# EAGLE design SparkFun_IMU_Breakout_ICM-20948_FET_EVAL (EAGLE 9.1.3)
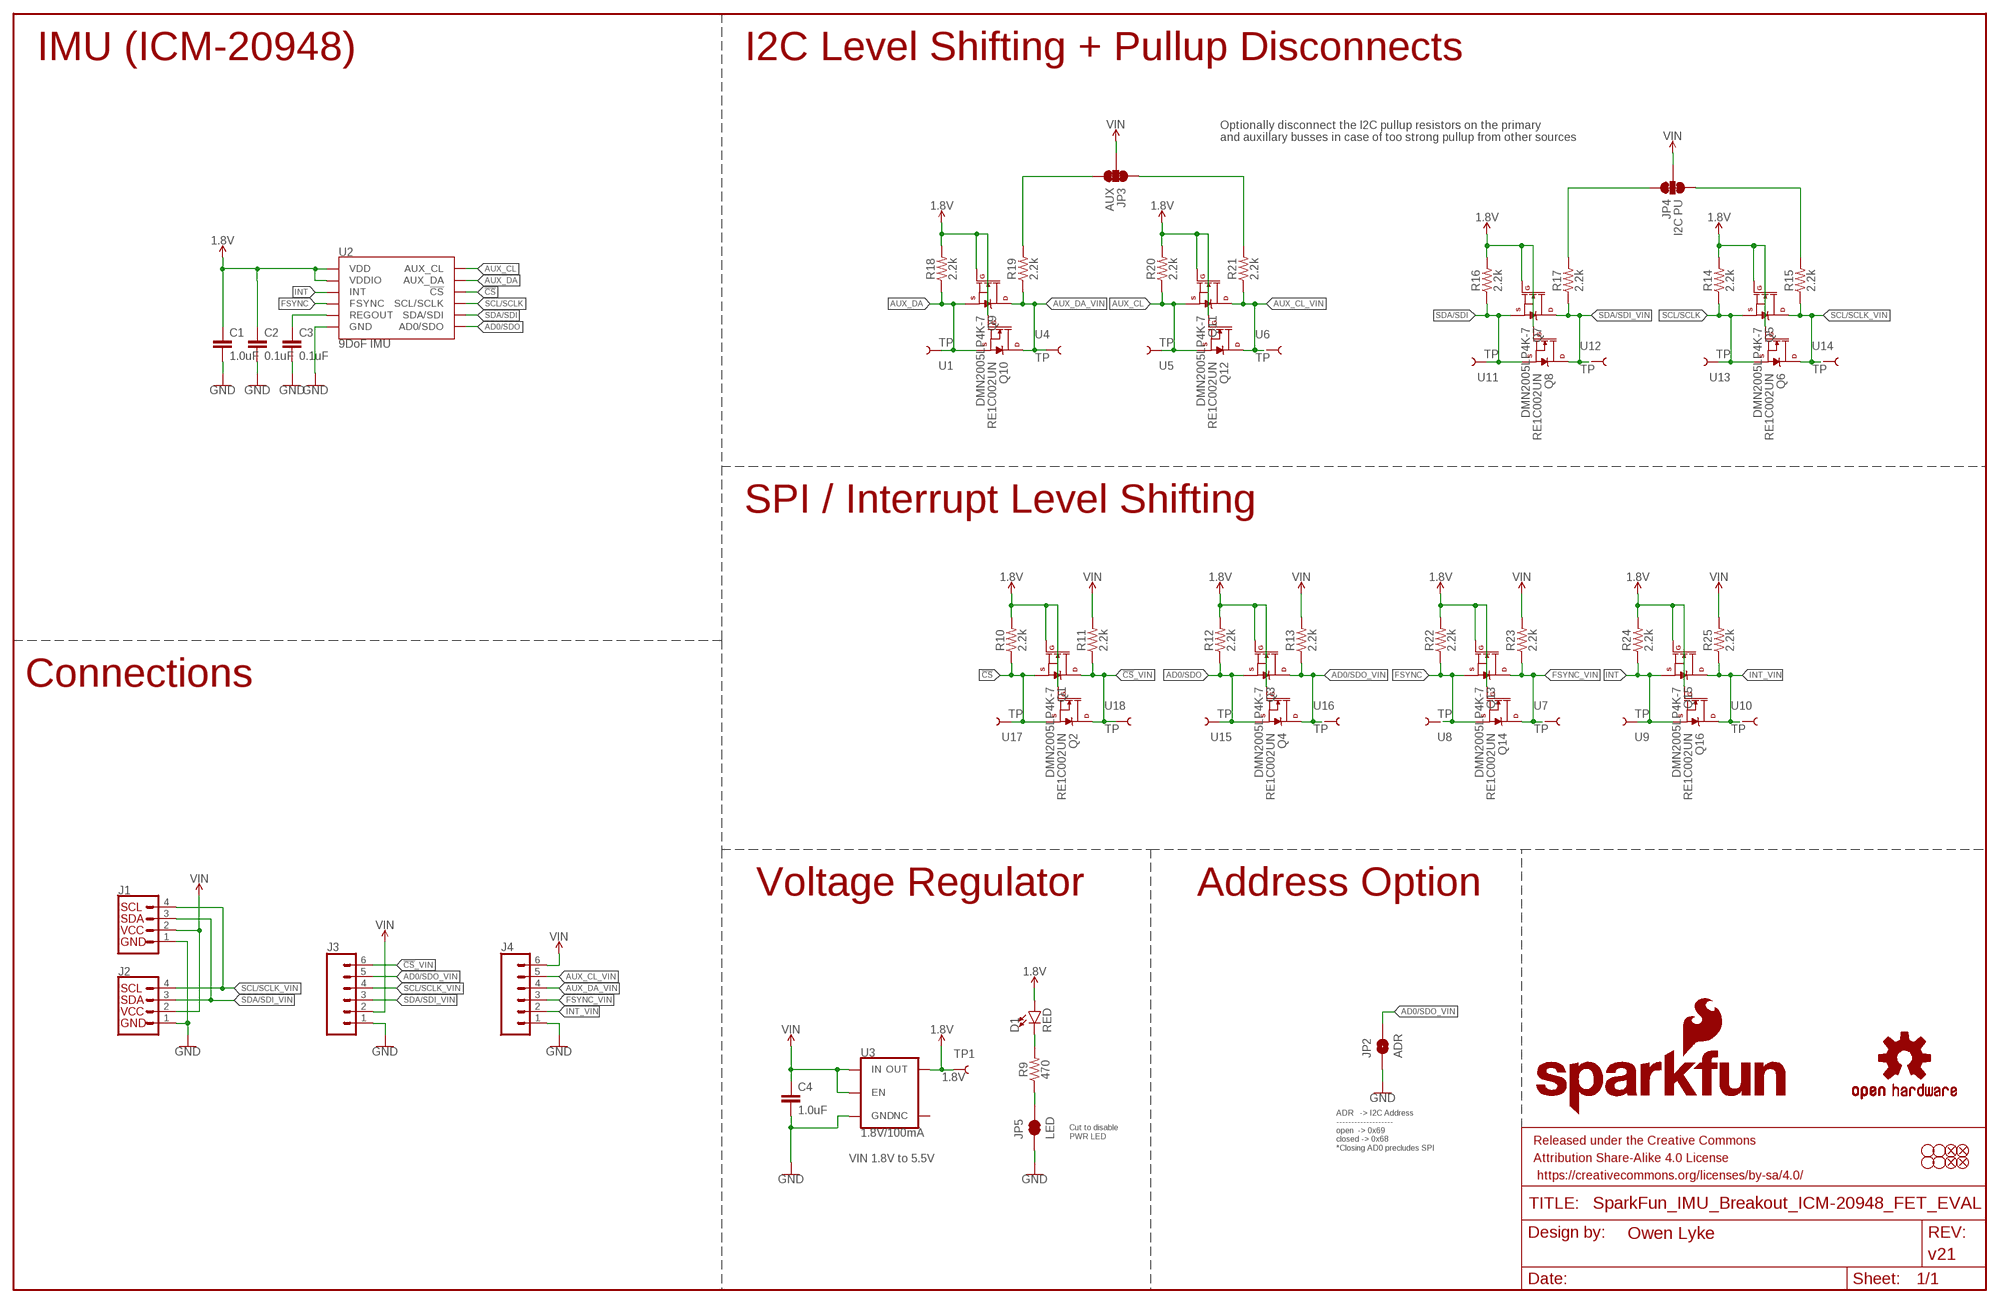
[diagram p0: schematic, sheet 1]

## Parts
C1  1.0uF  1.0UF-0603-16V-10%-X7R  [0603]
C2  0.1uF  0.1UF-0603-25V-5%  [0603]
C3  0.1uF  0.1UF-0603-25V-5%  [0603]
C4  1.0uF  1.0UF-0603-16V-10%-X7R  [0603]
D1  RED  LED-RED0603  [LED-0603]
FD1  FIDUCIAL1X2  [FIDUCIAL-1X2]
FD2  FIDUCIAL1X2  [FIDUCIAL-1X2]
FD3  FIDUCIAL1X2  [FIDUCIAL-1X2]
FD4  FIDUCIAL1X2  [FIDUCIAL-1X2]
FRAME2  FRAME-LEDGER  [CREATIVE_COMMONS]
H1  STAND-OFF  [STAND-OFF]
H2  STAND-OFF  [STAND-OFF]
H3  STAND-OFF  [STAND-OFF]
H4  STAND-OFF  [STAND-OFF]
J1  QWIIC_CONNECTORJS-1MM  [JST04_1MM_RA]
J2  QWIIC_CONNECTORJS-1MM  [JST04_1MM_RA]
J3  CONN_06NO_SILK_NO_POP  [1X06_NO_SILK]
J4  CONN_06NO_SILK_NO_POP  [1X06_NO_SILK]
JP2  ADR  JUMPER-SMT_2_NO_SILK  [SMT-JUMPER_2_NO_SILK]
JP3  AUX  JUMPER-SMT_3_2-NC_TRACE_SILK  [SMT-JUMPER_3_2-NC_TRACE_SILK]
JP4  I2C PU  JUMPER-SMT_3_2-NC_TRACE_SILK  [SMT-JUMPER_3_2-NC_TRACE_SILK]
JP5  LED  JUMPER-SMT_2_NC_TRACE_SILK  [SMT-JUMPER_2_NC_TRACE_SILK]
LOGO1  SFE_LOGO_NAME_FLAME.1_INCH  [SFE_LOGO_NAME_FLAME_.1]
LOGO2  OSHW-LOGOMINI  [OSHW-LOGO-MINI]
Q1  DMN2005LP4K-7  [AP02001]
Q2  RE1C002UN  [SOT-416FL]
Q3  DMN2005LP4K-7  [AP02001]
Q4  RE1C002UN  [SOT-416FL]
Q5  DMN2005LP4K-7  [AP02001]
Q6  RE1C002UN  [SOT-416FL]
Q7  DMN2005LP4K-7  [AP02001]
Q8  RE1C002UN  [SOT-416FL]
Q9  DMN2005LP4K-7  [AP02001]
Q10  RE1C002UN  [SOT-416FL]
Q11  DMN2005LP4K-7  [AP02001]
Q12  RE1C002UN  [SOT-416FL]
Q13  DMN2005LP4K-7  [AP02001]
Q14  RE1C002UN  [SOT-416FL]
Q15  DMN2005LP4K-7  [AP02001]
Q16  RE1C002UN  [SOT-416FL]
R9  470  470OHM-0603-1/10W-1%  [0603]
R10  2.2k  2.2KOHM-0402T-1/16W-1%  [0402-TIGHT]
R11  2.2k  2.2KOHM-0402T-1/16W-1%  [0402-TIGHT]
R12  2.2k  2.2KOHM-0402T-1/16W-1%  [0402-TIGHT]
R13  2.2k  2.2KOHM-0402T-1/16W-1%  [0402-TIGHT]
R14  2.2k  2.2KOHM-0402T-1/16W-1%  [0402-TIGHT]
R15  2.2k  2.2KOHM-0402T-1/16W-1%  [0402-TIGHT]
R16  2.2k  2.2KOHM-0402T-1/16W-1%  [0402-TIGHT]
R17  2.2k  2.2KOHM-0402T-1/16W-1%  [0402-TIGHT]
R18  2.2k  2.2KOHM-0402T-1/16W-1%  [0402-TIGHT]
R19  2.2k  2.2KOHM-0402T-1/16W-1%  [0402-TIGHT]
R20  2.2k  2.2KOHM-0402T-1/16W-1%  [0402-TIGHT]
R21  2.2k  2.2KOHM-0402T-1/16W-1%  [0402-TIGHT]
R22  2.2k  2.2KOHM-0402T-1/16W-1%  [0402-TIGHT]
R23  2.2k  2.2KOHM-0402T-1/16W-1%  [0402-TIGHT]
R24  2.2k  2.2KOHM-0402T-1/16W-1%  [0402-TIGHT]
R25  2.2k  2.2KOHM-0402T-1/16W-1%  [0402-TIGHT]
TP1  1.8V  TEST-POINT3  [PAD.03X.03]
U1  TP  [MINI_TEST_POINT]
U2  9DoF IMU  ICM-20948  [QFN24-3X3]
U3  1.8V/100mA  V_REG_SP6214-1.8V  [SC70]
U4  TP  [MINI_TEST_POINT]
U5  TP  [MINI_TEST_POINT]
U6  TP  [MINI_TEST_POINT]
U7  TP  [MINI_TEST_POINT]
U8  TP  [MINI_TEST_POINT]
U9  TP  [MINI_TEST_POINT]
U10  TP  [MINI_TEST_POINT]
U11  TP  [MINI_TEST_POINT]
U12  TP  [MINI_TEST_POINT]
U13  TP  [MINI_TEST_POINT]
U14  TP  [MINI_TEST_POINT]
U15  TP  [MINI_TEST_POINT]
U16  TP  [MINI_TEST_POINT]
U17  TP  [MINI_TEST_POINT]
U18  TP  [MINI_TEST_POINT]

## Nets
1.8V: C1.1 C2.1 D1.A Q1.G Q2.1(G) Q3.G Q4.1(G) Q5.G Q6.1(G) Q7.G Q8.1(G) Q9.G Q10.1(G) Q11.G Q12.1(G) Q13.G Q14.1(G) Q15.G Q16.1(G) R10.2 R12.2 R14.2 R16.2 R18.2 R20.2 R22.2 R24.2 TP1.P$1 U2.8(VDDIO) U2.13(VDD) U3.5(OUT)
!CS: Q1.S Q2.2(S) R10.1 U2.22(!CS) U17.P$1
!CS!_VIN: J3.6 Q1.D Q2.3(D) R11.1 U18.P$1
AD0/SDO: Q3.S Q4.2(S) R12.1 U2.9(AD0/SDO) U15.P$1
AD0/SDO_VIN: J3.5 JP2.2 Q3.D Q4.3(D) R13.1 U16.P$1
AUX_CL: Q11.S Q12.2(S) R20.1 U2.7(AUX_CL) U5.P$1
AUX_CL_VIN: J4.5 Q11.D Q12.3(D) R21.1 U6.P$1
AUX_DA: Q9.S Q10.2(S) R18.1 U1.P$1 U2.21(AUX_DA)
AUX_DA_VIN: J4.4 Q9.D Q10.3(D) R19.1 U4.P$1
FSYNC: Q13.S Q14.2(S) R22.1 U2.11(FSYNC) U8.P$1
FSYNC_VIN: J4.3 Q13.D Q14.3(D) R23.1 U7.P$1
GND: C1.2 C2.2 C3.2 C4.2 J1.1 J2.1 J3.1 J4.1 JP2.1 JP5.1 U2.18(GND) U2.20(GND) U3.2(GND)
INT: Q15.S Q16.2(S) R24.1 U2.12(INT) U9.P$1
INT_VIN: J4.2 Q15.D Q16.3(D) R25.1 U10.P$1
N$1: C3.1 U2.10(REGOUT)
N$2: JP4.3 R15.2
N$3: JP4.1 R17.2
N$4: JP3.1 R21.2
N$5: JP3.3 R19.2
N$9: D1.C R9.2
N$10: JP5.2 R9.1
SCL/SCLK: Q5.S Q6.2(S) R14.1 U2.23(SCL/SCLK) U13.P$1
SCL/SCLK_VIN: J1.4 J2.4 J3.4 Q5.D Q6.3(D) R15.1 U14.P$1
SDA/SDI: Q7.S Q8.2(S) R16.1 U2.24(SDA/SDI) U11.P$1
SDA/SDI_VIN: J1.3 J2.3 J3.3 Q7.D Q8.3(D) R17.1 U12.P$1
VIN: C4.1 J1.2 J2.2 J3.2 J4.6 JP3.2 JP4.2 R11.2 R13.2 R23.2 R25.2 U3.1(IN) U3.3(EN)
Unconnected: U3.4(NC)

## Notes on the sheet
- IMU (ICM-20948) | I2C Level Shifting + Pullup Disconnects
- Optionally disconnect the I2C pullup resistors on the primary
  and auxillary busses in case of too strong pullup from other sources
- SPI / Interrupt Level Shifting
- Connections
- Voltage Regulator | Address Option
- Cut to disable
  PWR LED
- ADR   -> I2C Address
  -------------------
  open  -> 0x69
  closed -> 0x68
  *Closing AD0 precludes SPI
- VIN 1.8V to 5.5V

## Library data of the parts
C1 C4 = SparkFun-Capacitors:1.0UF: 1µF ceramic capacitors A capacitor is a passive two-terminal electrical component used to store electrical energy temporarily in an electric field.; PROD_ID: CAP-13930
C2 C3 = SparkFun-Capacitors:0.1UF: 0.1µF ceramic capacitors A capacitor is a passive two-terminal electrical component used to store electrical energy temporarily in an electric field.; PROD_ID: CAP-08604
D1 = SparkFun-LED:LED-RED: Red SMD LED Used in manufacturing of most products at SparkFun Packages: 0603 - SMD 0603 package [Product Link] <http://docs.avagotech.com/docs/AV02-0551EN> 0603 SMART - SMD 0603 SMART package ( more efficient and expensive)[Product Link] <http://www.osram-os.com/Graphics/XPic2/00077099_0.pdf> 1206 - SMD1206 package [Product Link] <https://www.sparkfun.com/datasheets/DevTools/LilyPad/Q150OVS4.pdff> SparkFun Products: Pro Mini 328 -5V <https://www.sparkfun.com/products/821> RedBoard <https://www.sparkfun.com/products/12757> IOIO-OTG <https://www.sparkfun.com/products/13613>; PROD_ID: DIO-00819
FD1-FD4 = SparkFun-Aesthetics:FIDUCIAL: Fiducial Alignment Points Point-of-reference for pick-and-place machines and other optical instruments.
FRAME2 = SparkFun-Aesthetics:FRAME-LEDGER: Schematic Frame - Ledger Standard 11x14 US Ledger frame; DESIGNER: Owen Lyke; REV: v21
H1-H4 = SparkFun-Hardware:STAND-OFF: Stand Off Drill holes for mechanically mounting via screws, standoffs, etc. Note: Use the keepout ring to avoid running the screw head into surrounding components. Variant Overviews STAND-OFF - Mechanical footprint for a #4 phillips button head screw. STAND-OFF-TIGHT - Mechanical footprint for a #4 phillips button head screw, Example SparkFun Products Screw - Phillips Head (1/4", 4-40, 10 pack) <https://www.sparkfun.com/products/10453> (PRT-10453) Screw - Phillips Head (1/2", 4-40, 10 pack) <https://www.sparkfun.com/products/10452> (PRT-10452) Screw - Phillips Head (3/4", 4-40, 10 pack) <https://www.sparkfun.com/products/10451> (PRT-10451) Screw - Phillips Head (1", 4-40, 10 pack) <https://www.sparkfun.com/products/10450> (PRT-10450)
J1 J2 = SparkFun-Connectors:QWIIC_CONNECTOR: SparkFun I2C Standard Qwiic Connector An SMD 1mm pitch JST connector makes it easy and quick (get it? Qwiic?) to connect I2C devices to each other. The Qwiic system <http://www.sparkfun.com/qwiic> enables fast and solderless connection between popular platforms and various sensors and actuators. We carry 200mm <https://www.sparkfun.com/products/14204>, 100mm <https://www.sparkfun.com/products/14205>, 50mm <https://www.sparkfun.com/products/14206>, and breadboard friendly <https://www.sparkfun.com/products/14207> Qwiic cables. We also offer 10 pcs strips <https://www.sparkfun.com/products/14323> the SMD connectors.; PROD_ID: CONN-13694
J3 J4 = SparkFun-Connectors:CONN_06: Multi connection point. Often used as Generic Header-pin footprint for 0.1 inch spaced/style header connections On any of the 0.1 inch spaced packages, you can populate with these: Break Away Headers - Straight <https://www.sparkfun.com/products/116> (PRT-00116) Break Away Male Headers - Right Angle <https://www.sparkfun.com/products/553> (PRT-00553) Female Headers <https://www.sparkfun.com/products/115> (PRT-00115) Break Away Headers - Machine Pin <https://www.sparkfun.com/products/117> (PRT-00117) Break Away Female Headers - Swiss Machine Pin <https://www.sparkfun.com/products/743> (PRT-00743) Arduino Stackable Header - 6 Pin <https://www.sparkfun.com/products/9280> (PRT-09280) For SCREWTERMINALS and SPRING TERMINALS visit here: Screw Terimnals on SparkFun.com <https://www.sparkfun.com/search/results?term=Screw+Terminals> (5mm/3.5mm/2.54mm spacing) This device is also useful as a general connection point to wire up your design to another part of your project. Our various solder wires solder well into these plated through hole pads. Hook-Up Wire - Assortment (Stranded, 22 AWG) <https://www.sparkfun.com/products/11375> (PRT-11375) Hook-Up Wire - Assortment (Solid Core, 22 AWG) <https://www.sparkfun.com/products/11367> (PRT-11367) View the entire wire category on our website here <https://www.sparkfun.com/categories/141>
JP2 = SparkFun-Jumpers:JUMPER-SMT_2_NO: Normally open jumper This jumper has two pads in close proximity to each other. Apply solder to close the connection. Round pads are easier to solder for beginners, but are a lot larger. SparkFun Product that uses the round pads: SparkFun EL Sequencer <https://www.sparkfun.com/products/12781>
JP3 JP4 = SparkFun-Jumpers:JUMPER-SMT_3_2-NC_TRACE: Normally closed trace jumper (2 of 2 connections) This jumper has a trace between all three pads so they are normally closed (NC). Use a razor knife to open the connection(s). For best results follow the IPC guidelines for cutting traces: Cutout at least 0.063 mm (0.005 in). Remove all loose material to clean up the cut area. Seal the cut with an approved epoxy. Reapply solder to reclose the connection(s).
JP5 = SparkFun-Jumpers:JUMPER-SMT_2_NC_TRACE: Normally closed trace jumper This jumper has a trace between two pads so it's normally closed (NC). Use a razor knife to open the connection. For best results follow the IPC guidelines for cutting traces: Cutout at least 0.063 mm (0.005 in). Remove all loose material to clean up the cut area. Seal the cut with an approved epoxy. Reapply solder to reclose the connection.
LOGO1 = SparkFun-Aesthetics:SFE_LOGO_NAME_FLAME: SparkFun Font Logo w/ Flame This is the SparkFun full logo. The logo on the schematic will always be the same size; the package variant is the height of the flame part of the logo. Default layer for the logo on the board is tSilk.
LOGO2 = SparkFun-Aesthetics:OSHW-LOGO: Open-Source Hardware (OSHW) Logo This logo indicates the piece of hardware it is found on incorporates a OSHW license and/or adheres to the definition of open source hardware found here: http://freedomdefined.org/OSHW
Q1 Q3 Q5 Q7 Q9 Q11 Q13 Q15 = new_fets:DMN2005LP4K-7
Q2 Q4 Q6 Q8 Q10 Q12 Q14 Q16 = new_fets:RE1C002UN
R9 = SparkFun-Resistors:470OHM: 470Ω resistor A resistor is a passive two-terminal electrical component that implements electrical resistance as a circuit element. Resistors act to reduce current flow, and, at the same time, act to lower voltage levels within circuits. - Wikipedia; PROD_ID: RES-07869
R10-R25 = SparkFun-Resistors:2.2KOHM: 2.2kΩ resistor A resistor is a passive two-terminal electrical component that implements electrical resistance as a circuit element. Resistors act to reduce current flow, and, at the same time, act to lower voltage levels within circuits. - Wikipedia; PROD_ID: RES-14341
TP1 = SparkFun-Connectors:TEST-POINT: SparkFun Test Points Bare copper test points for troubleshooting or In-Circuit-Testing. These are used by our Production team for verifying production board runs using pogo-pins on test beds. SparkFun Products: SparkFun LSM9DS1 Breakout <https://www.sparkfun.com/products/13284> SparkFun PSOC <https://www.sparkfun.com/products/13714> SparkFun Load Cell Amplifier <https://www.sparkfun.com/products/13879>
U1 U4-U18 = new_fets:TP
U2 = SparkFun-Sensors:ICM-20948: ICM-20948 9 Degree of Freedom IMU World’s lowest power 9-axis MotionTracking device that is ideally suited for smartphones, tablets, wearable sensors, and IoT applications. Includes onboard Digital Motion Processor to offload computations from the host processor Datasheet <https://cdn.sparkfun.com/assets/learn_tutorials/5/5/0/MPU9250REV1.0.pdf> SparkFun Products: SparkFun IMU Breakout - ICM-20948 <https://www.sparkfun.com/products/15182>; PROD_ID: IC-14247
U3 = SparkFun-IC-Power:V_REG_SP6214: Voltage Regulator - SP6214 SP6214 Series SC-70-5 Micropower SC-70 100 mA CMOS LDO Regulator Datasheet <https://www.exar.com/content/document.ashx?id=654> SparkFun Products: MP3 Trigger <https://www.sparkfun.com/products/13720> SparkFun Particle Sensor Breakout <https://www.sparkfun.com/products/14045>; PROD_ID: VREG-08428

## Board
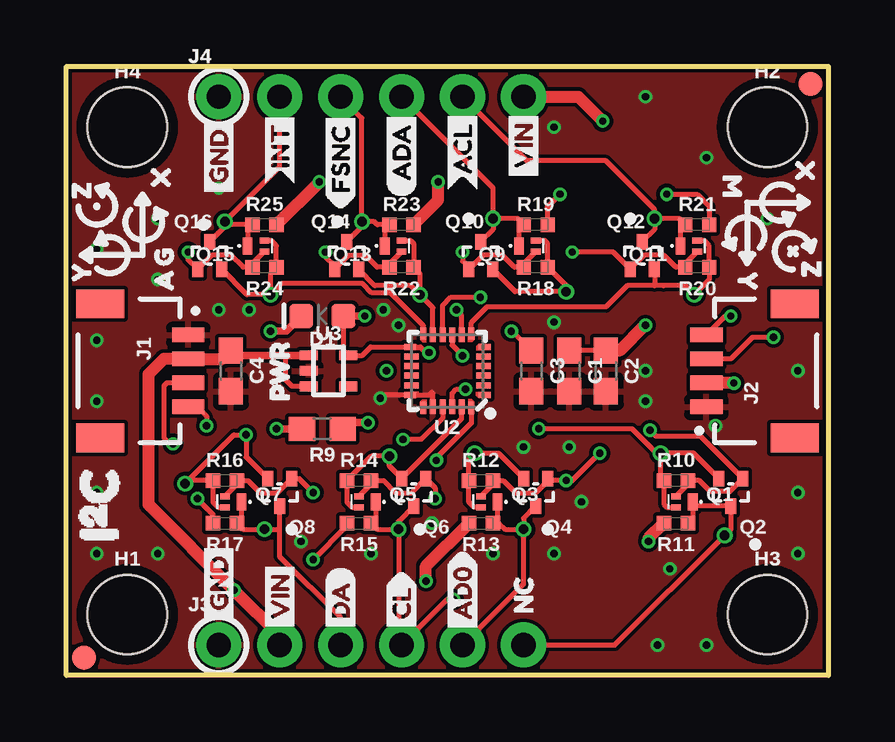
[diagram p1: board, top side]
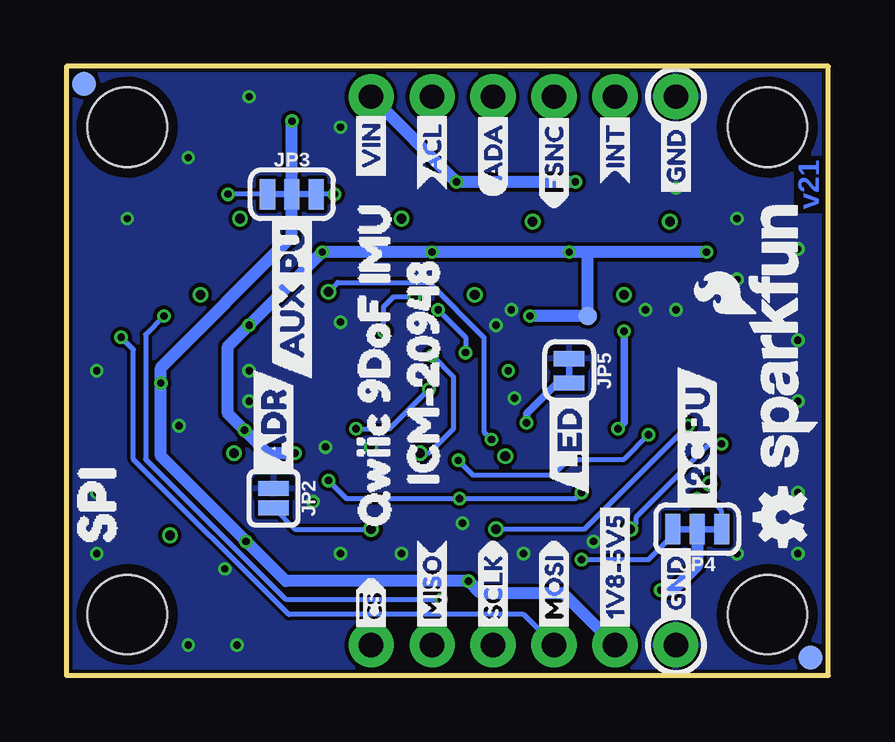
[diagram p2: board, bottom side, seen from below]

Size 31.75 x 25.4 mm. Coordinates in mm from the lower left corner, seen from the top.
Outline: 0,0 0,25.4 31.75,25.4 31.75,0 0,0
Copper layers (1*16): Top 0.035mm / dielectric 1.5mm / Bottom 0.035mm
Design rules "SparkFun-2-layer-FAB-LIMIT": minimum track width 4mil, minimum drill 6mil, track to track 4mil, track to pad 4mil, pad to pad 4mil, via to via 4mil, smd to smd 4mil, copper to edge 4mil, drill to drill 4mil, minimum pad ring 5mil, minimum via ring 5mil, stop-mask expansion 4mil, vias tented up to drill 25mil, thermal gap 10mil

### Footprints (pad centres in the part's own frame; a part is rotated, then mirrored left to right if it is on the bottom)
0603 = smd 1.1 x 1: 1 -0.85,0; 2 0.85,0
LED-0603 = smd 1 x 1: A -0.877,0; C 0.877,0
FIDUCIAL-1X2 = smd 1 x 1: 1 0,0
STAND-OFF = hole 3.302: 0,0
JST04_1MM_RA = smd 0.6 x 1.35: 1 -1.5,0; 2 -0.5,0; 3 0.5,0; 4 1.5,0 | smd 1.2 x 2: NC1 2.8,-3.675; NC2 -2.8,-3.675
1X06_NO_SILK = drill 1.016 pad 1.88: 1 0,0; 2 2.54,0; 3 5.08,0; 4 7.62,0; 5 10.16,0; 6 12.7,0
SMT-JUMPER_2_NO_SILK = smd 0.635 x 1.27: 1 -0.406,0; 2 0.406,0
SMT-JUMPER_3_2-NC_TRACE_SILK = smd 0.635 x 1.27: 1 -1.016,0; 2 0,0; 3 1.016,0
SMT-JUMPER_2_NC_TRACE_SILK = smd 0.635 x 1.27: 1 -0.508,0; 2 0.508,0
AP02001 = smd 0.4 x 0.7: D 0.7,0 | smd 0.4 x 0.25: G 0,0.225; S 0,-0.225
SOT-416FL = smd 0.46 x 0.65: 1 -0.5,-1.1; 2 0.5,-1.1; 3 0,0.05
0402-TIGHT = smd 0.6 x 0.6: 1 -0.5,0; 2 0.5,0
PAD.03X.03 = smd 0.762 x 0.762: P$1 0,0
MINI_TEST_POINT = drill 0.4: P$1 0,0
QFN24-3X3 = smd 0.495 x 0.25: 1 -1.552,1; 6 -1.552,-1; 13 1.552,-1; 18 1.552,1 | smd 0.6 x 0.25: 2 -1.5,0.6; 3 -1.5,0.2; 4 -1.5,-0.2; 5 -1.5,-0.6; 14 1.5,-0.6; 15 1.5,-0.2; 16 1.5,0.2; 17 1.5,0.6 | smd 0.25 x 0.495: 7 -1,-1.552; 12 1,-1.552; 19 1,1.552; 24 -1,1.552 | smd 0.25 x 0.6: 8 -0.6,-1.5; 9 -0.2,-1.5; 10 0.2,-1.5; 11 0.6,-1.5; 20 0.6,1.5; 21 0.2,1.5; 22 -0.2,1.5; 23 -0.6,1.5
SC70 = smd 0.4 x 0.75: 1 -0.65,-0.825; 2 0,-0.825; 3 0.65,-0.825; 4 0.65,0.825; 5 -0.65,0.825

### Placement (x,y rotation side)
C1  20.95,12.7 270 top
C2  22.48,12.7 270 top
C3  19.38,12.7 270 top
C4  6.86,12.7 270 top
D1  10.67,14.99 180 top
FD1  0.74,0.74 0 bottom
FD2  31.01,24.66 0 bottom
FD3  31.01,24.66 0 top
FD4  0.74,0.74 0 top
FRAME2  -5.71,-15.62 0 top  (outside the outline)
H1  2.54,2.54 0 top
H2  29.21,22.86 0 top
H3  29.21,2.54 0 top
H4  2.54,22.86 0 top
J1  5.08,12.7 270 top
J2  26.67,12.7 90 top
J3  6.35,1.27 0 top
J4  6.35,24.13 0 top
JP2  23.11,7.39 270 bottom
JP3  22.35,20.07 0 bottom
JP4  5.46,6.1 180 bottom
JP5  10.79,12.7 270 bottom
LOGO1  1.91,14.22 90 bottom
LOGO2  1.91,6.6 90 bottom
Q1  25.4,7.24 0 top
Q2  27.69,7.11 180 top
Q3  17.27,7.24 0 top
Q4  19.56,7.11 180 top
Q5  12.19,7.24 0 top
Q6  14.48,7.11 180 top
Q7  6.6,7.24 0 top
Q8  8.89,7.11 180 top
Q9  19.56,17.91 180 top
Q10  17.27,18.03 0 top
Q11  26.29,17.91 180 top
Q12  24,18.03 0 top
Q13  13.97,17.91 180 top
Q14  11.68,18.03 0 top
Q15  8.26,17.91 180 top
Q16  5.97,18.03 0 top
R9  10.67,10.29 180 top
R10  25.4,8.13 0 top
R11  25.4,6.35 180 top
R12  17.27,8.13 0 top
R13  17.27,6.35 180 top
R14  12.19,8.13 0 top
R15  12.19,6.35 180 top
R16  6.6,8.13 0 top
R17  6.6,6.35 180 top
R18  19.56,17.02 180 top
R19  19.56,18.8 0 top
R20  26.29,17.02 180 top
R21  26.29,18.8 0 top
R22  13.97,17.02 180 top
R23  13.97,18.8 0 top
R24  8.26,17.02 180 top
R25  8.26,18.8 0 top
TP1  10.03,14.99 90 bottom
U1  20.83,16 180 top
U2  15.88,12.7 180 top
U3  10.92,12.7 270 top
U4  17.78,19.05 180 top
U5  26.16,15.88 180 top
U6  24.51,19.05 180 top
U7  12.32,18.92 180 top
U8  14.73,15.88 180 top
U9  8.51,15.88 180 top
U10  6.6,18.92 180 top
U11  4.95,8 0 top
U12  8.26,6.1 0 top
U13  13.46,9.14 0 top
U14  13.84,6.1 0 top
U15  17.02,9.27 0 top
U16  19.05,6.1 0 top
U17  24.77,9.27 0 top
U18  27.43,5.84 0 top
U$1  [GND4]  6.35,2.03 90 bottom
U$2  [GND4]  6.35,19.81 90 bottom
U$3  [PWR0]  8.89,10.79 90 top
U$4  [INT3]  8.89,20.45 90 bottom
U$5  [FSNC2]  11.43,19.43 90 bottom
U$6  [ACL1]  16.51,20.19 90 bottom
U$7  [ADA0]  13.97,19.94 90 bottom
U$8  [MISO13]  16.51,1.65 90 bottom
U$9  [MOSI14]  11.43,1.65 90 bottom
U$10  [SCLK15]  13.97,1.65 90 bottom
U$11  [#CS16]  19.05,1.52 90 bottom
U$12  [1V8#5V57]  8.89,1.65 90 bottom
U$13  [VIN5]  8.89,1.65 90 top
U$14  [NC17]  19.05,1.91 90 top
U$15  [CL4]  13.97,1.65 90 top
U$16  [DA2]  11.43,1.65 90 top
U$17  [AD012]  16.51,1.65 90 top
U$18  [ADA0]  13.97,19.94 90 top
U$19  [ACL1]  16.51,20.19 90 top
U$20  [FSNC2]  11.43,19.43 90 top
U$21  [INT3]  8.89,20.45 90 top
U$22  [GND4]  6.35,2.03 90 top
U$23  [ADR2]  23.11,8 90 bottom
U$24  [GND4]  6.35,19.81 90 top
U$25  [I2C_PU21]  5.46,6.6 90 bottom
U$26  [SPI19]  30.48,4.19 90 bottom
U$27  [AUX_PU24]  22.35,12.32 90 bottom
U$29  [LED23]  10.79,7.49 90 bottom
U$30  [VIN5]  19.05,20.45 90 top
U$31  [ICM#2094820]  16.89,6.86 90 bottom
U$34  [X0]  3.94,19.68 90 top
U$35  [Y1]  0.64,15.75 90 top
U$36  [Z2]  0.64,19.18 90 top
U$37  [G5]  4.06,16.38 90 top
U$38  [A4]  4.06,15.37 90 top
U$39  [M3]  27.76,21.56 270 top
U$40  [X0]  30.79,19.97 90 top
U$41  [Y1]  28.4,17.49 270 top
U$42  [Z2]  31.04,15.91 90 top
U$43  [QWIIC_9DOF_IMU_0]  18.92,5.08 90 bottom
U$44  [VIN5]  19.05,20.45 90 bottom
U$45  [I#C1]  1.37,4.25 90 top

### Tracks (layer width: path | path; a pad name or v marks a point on that pad's centre or on a via)
1.8V  (via drill 0.3)
  Top 0.203: Q1.G 25.9,7.96 R10.2 26.36,8.13 26.82,7.67 27.64,7.67 Q2.1 26.43,9.97 24.57,9.97 v24.32,10.22 | Q3.G 17.77,7.96 R12.2 18.2,8.13 18.72,7.61 19.56,7.61 20.06,8.11 20.06,8.13 | Q5.G 12.69,7.96 R14.2 13.21,8.13 13.72,7.62 14.39,7.62 Q6.1 15.37,7.82 v15.37,7.37 | Q7.G 7.1,7.96 R16.2 7.57,8.13 8.08,7.62 8.8,7.62 Q8.1 9.7,8.21 v10.29,7.62 | Q9.G 19.06,17.18 R18.2 18.67,17.02 18.16,17.53 17.36,17.53 16.81,16.97 | Q11.G 25.79,17.18 R20.2 25.4,17.02 24.89,17.53 24.09,17.53 Q12.1 22.78,17.65 v21.08,17.65 | Q15.G 7.75,17.18 R24.2 7.37,17.02 6.86,17.53 6.06,17.53 Q16.1 5.08,17.32 v5.08,17.65 | Q13.G 13.47,17.18 R22.2 12.95,17.02 12.45,17.53 11.78,17.53 Q14.1 11.18,17.06 10.79,17.45 v10.79,17.65 | 20.06,8.13 Q4.1 | 16.81,16.97 Q10.1 | v16.51,17.65 16.51,17.27 16.81,16.97 | 20.06,8.13 v20.83,8.13 21.08,8.13 v22.23,9.27 | C2.1 C1.1 | U2.8 16.48,15.02 v16.26,15.24 | D1.A 11.54,13.55 U3.5 12.33,13.35 12.68,13.7 U2.13 14.75,13.7 14.99,13.46 v15.11,13.46
  Top 0.305: D1.A v12.43,14.99
  Top 0.508: C2.1 23.07,13.55 v24.13,14.61
  Bottom 0.203: 20.95,17.65 v21.08,17.65 | v10.29,7.62 10.54,7.37 v15.37,7.37 20.07,7.37 v20.83,8.13 | v16.26,15.24 15.11,14.1 v15.11,13.46
  Bottom 0.508: v21.08,17.65 v24.13,14.61 24.19,14.54 25.02,13.72 25.02,10.92 v24.32,10.22 23.37,9.27 v22.23,9.27 | v5.08,17.65 10.03,17.65 | 10.03,17.65 v10.79,17.65 v16.51,17.65 20.95,17.65 | 10.03,17.65 TP1.P$1 v12.43,14.99
!CS  (via drill 0.3)
  Top 0.203: U2.22 16.07,11.76 16.26,11.94 v16.64,11.94 | Q1.S 25.02,7.01 24.9,7.13 R10.1 24.77,8.26 U17.P$1 | U17.P$1 26.13,9.27 Q2.2 | U17.P$1 24.59,9.27 23.57,10.29 20.45,10.29 v19.68,10.29
  Bottom 0.203: v19.68,10.29 18.29,10.29 v16.64,11.94
!CS!_VIN
  Top 0.203: R11.1 26.1,6.54 Q1.D 26.28,7.06 Q2.3 27.69,6.1 U18.P$1 22.86,1.27 J3.6
AD0/SDO  (via drill 0.3)
  Top 0.203: Q3.S 16.99,7.01 16.76,7.24 R12.1 16.77,9.03 U15.P$1 18,9.27 Q4.2 | U2.9 16.07,13.77 v16.51,13.34
  Bottom 0.203: v16.51,13.34 15.62,12.45 15.62,12.19 15.62,11.18 15.62,10.29 16.32,9.59 16.64,9.27 U15.P$1
AD0/SDO_VIN
  Top 0.203: U16.P$1 19.05,6.55 Q4.3 | Q3.D 17.97,6.55 R13.1 18.03,6.35 18.28,6.1 U16.P$1 | J3.5 19.05,3.81 U16.P$1
  Bottom 0.203: U16.P$1 22.23,6.1 JP2.2
AUX_CL
  Top 0.203: Q11.S 26.57,18.13 26.79,17.91 R20.1 26.79,16.5 U5.P$1 25.78,16.26 24.89,16.26 24.51,16.26 | U2.7 16.88,14.72 17.53,15.37 22.48,15.37 23.37,16.26 24.51,16.26 | Q12.2 24.51,16.26
AUX_CL_VIN
  Top 0.203: Q11.D 25.59,18.6 R21.1 25.54,19.05 U6.P$1 | U6.P$1 24.51,18.59 Q12.3 | J4.5 19.18,21.46 22.48,21.46 24.51,19.43 U6.P$1
AUX_DA  (via drill 0.3)
  Top 0.203: Q9.S 19.94,18.13 20.06,18.01 R18.1 20.83,16.25 U1.P$1 18.7,16 Q10.2 | U2.21 15.68,10.72 14.79,9.84 v14.04,9.84
  Bottom 0.203: v14.04,9.84 14.35,10.16 14.35,14.1 16.64,16.38 20.45,16.38 U1.P$1
AUX_DA_VIN
  Top 0.203: Q9.D 18.86,18.6 R19.1 18.8,19.05 U4.P$1 | U4.P$1 17.78,18.59 Q10.3 | J4.4 17.72,20.38 17.78,20.32 U4.P$1
FSYNC
  Top 0.203: Q13.S 14.35,18.13 14.47,18.01 R22.1 14.73,16.76 U8.P$1 | Q14.2 12.86,16.26 14.35,16.26 U8.P$1 | U2.11 15.28,15.33 U8.P$1
FSYNC_VIN
  Top 0.203: Q13.D 13.27,18.6 R23.1 12.96,18.8 12.84,18.92 U7.P$1 | U7.P$1 12.32,18.72 Q14.3 | U7.P$1 12.32,23.24 J4.3
GND  (via drill 0.3)
  Top 0.203: U2.20 15.28,11.78 15.24,11.81 15.13,11.7 U2.18 13.22,11.7 v13.08,11.56
  other vias: 1.27,11.43 1.27,13.97 1.27,17.78 3.81,19.05 6.35,20.32 3.81,16.51 20.32,22.86 24.13,24.13 26.67,21.59 29.21,19.05 20.32,14.73 30.48,12.7 30.48,7.62 30.48,5.08 26.67,1.27 24.64,1.27 20.32,5.08 17.78,5.08 12.7,5.08 3.81,5.08 1.27,5.08 1.27,7.62 19.05,9.53 20.95,9.53 15.24,6.35 6.35,15.24 7.62,15.24 13.21,15.24 13.84,14.61 24.13,12.7 24.13,11.43 9.78,5.59 27.05,10.41 21.46,7.24 25.15,4.45
  pour Top (isolate 0.152): 0,25.4 31.75,25.4 31.75,0 0,0
  pour Bottom (isolate 0.152): 0,25.4 31.75,25.4 31.75,0 0,0
INT
  Top 0.203: Q15.S 8.54,18.13 8.76,17.91 R24.1 8.5,16.76 U9.P$1 | U9.P$1 7.53,15.88 Q16.2 | U2.12 14.88,14.59 13.51,15.95 12.74,15.95 12.36,16.33 8.97,16.33 U9.P$1
INT_VIN
  Top 0.203: Q15.D 7.55,18.6 R25.1 6.73,18.8 U10.P$1 | U10.P$1 6.6,18.72 Q16.3 | U10.P$1 8.89,21.21 J4.2
N$1  (via drill 0.3)
  Top 0.203: U2.10 15.68,15.42 16.03,15.77 v17.25,15.77 | v18.54,14.35 18.58,14.35 C3.1
  Bottom 0.203: v18.54,14.35 18.54,15.37 18.14,15.77 v17.25,15.77
N$2  (via drill 0.3)
  Top 0.203: v10.29,4.83 11.69,6.23 R15.2
  Bottom 0.203: JP4.3 6.48,5.84 7.49,4.83 v10.29,4.83
N$3  (via drill 0.3)
  Top 0.203: v5.46,7.37 6.1,6.72 R17.2
  Bottom 0.203: JP4.1 4.45,6.86 4.95,7.37 v5.46,7.37
N$4  (via drill 0.3)
  Top 0.203: v25.02,20.07 26.29,20.07 26.8,19.56 R21.2
  Bottom 0.203: JP3.1 v25.02,20.07
N$5  (via drill 0.3)
  Top 0.203: R19.2 20.06,19.55 v20.57,20.07
  Bottom 0.203: v20.57,20.07 JP3.3
N$9  (via drill 0.3)
  Top 0.305: v8.76,10.29 R9.2 | v8.51,14.35 9.16,14.35 D1.C
  Bottom 0.305: v8.76,10.29 8.51,10.54 v8.51,14.35
N$10  (via drill 0.3)
  Top 0.305: v12.57,10.54 11.77,10.54 R9.1
  Bottom 0.305: JP5.2 11.3,12.19 12.57,10.92 v12.57,10.54
N$36  (via drill 0.3)
  other vias: 13.34,12.7
SCL/SCLK
  Top 0.203: Q5.S 11.91,7.01 11.69,7.23 R14.1 12.71,9.14 U13.P$1 13.46,8.73 Q6.2 16.48,10.71 U2.23
SCL/SCLK_VIN  (via drill 0.3)
  Top 0.203: U14.P$1 12.95,6.1 R15.1 12.89,6.55 Q5.D | Q6.3 13.84,6.43 U14.P$1 | v5.84,10.41 5.84,10.82 5.46,11.2 J1.4 | v27.69,14.99 27.46,14.99 J2.4 | v16.13,3.17 15.88,3.17 J3.4 13.84,1.4 U14.P$1
  Bottom 0.203: U14.P$1 10.16,6.1 7.05,9.21 v5.84,10.41 | v16.13,3.17 22.61,3.17 28.45,9.02 28.45,14.22 v27.69,14.99
SDA/SDI  (via drill 0.3)
  Top 0.203: Q7.S 6.32,7.01 6.1,7.23 R16.1 5.08,8.13 U11.P$1 6.99,10.03 v7.49,10.03 7.49,9.11 Q8.2 | U2.24 16.88,10.53 15.42,9.07 v15.42,8.97
  Bottom 0.203: v15.42,8.97 14.81,8.36 11.46,8.36 10.81,9.02 8.51,9.02 v7.49,10.03
SDA/SDI_VIN  (via drill 0.3)
  Top 0.203: v29.46,14.1 28.58,14.1 27.69,13.2 J2.3 | J1.3 4.19,12.2 4.06,12.07 4.06,9.91 4.32,9.65 v4.45,9.65 | J3.3 11.43,2.41 8.89,4.95 8.89,6.1 | 8.89,6.1 8.89,6.35 Q8.3 | 8.89,6.1 U12.P$1 7.36,6.1 R17.1 7.3,6.55 Q7.D
  Bottom 0.203: J3.3 12.7,2.54 22.48,2.54 28.96,9.02 28.96,13.59 v29.46,14.1 | v4.45,9.65 4.95,9.65 8.02,6.58 8.02,6.33 U12.P$1
VIN  (via drill 0.3)
  Top 0.203: U3.3 9.41,12.05 9.14,12.32 9.14,13.35
  Top 0.305: C4.1 7.06,13.35 9.14,13.35 U3.1
  Top 0.508: C4.1 6.51,13.2 J1.2 4.06,13.2 3.43,12.56 3.43,7.11 v6.99,3.56 8.89,1.65 J3.2 | v24.26,5.59 24.26,5.71 R11.2 | v14.99,3.94 14.99,4.56 R13.2 | v27.81,12.19 J2.2 | v10.54,20.57 v10.53,20.57 R25.2 | R23.2 15.49,19.82 v15.49,20.57 | J4.6 21.34,24.13 v22.35,23.11
  Bottom 0.508: JP4.2 5.46,4.57 6.48,3.56 v6.99,3.56 | v10.54,20.57 v15.49,20.57 J4.6 | v22.35,23.11 22.35,20.95 JP3.2 22.35,18.29 27.81,12.83 v27.81,12.19 27.81,9.14 v24.26,5.59 22.61,3.94 v14.99,3.94 14.48,3.43 11.05,3.43 J3.2

### Text on the board
Bottom: v21
tDocu: Owen Lyke